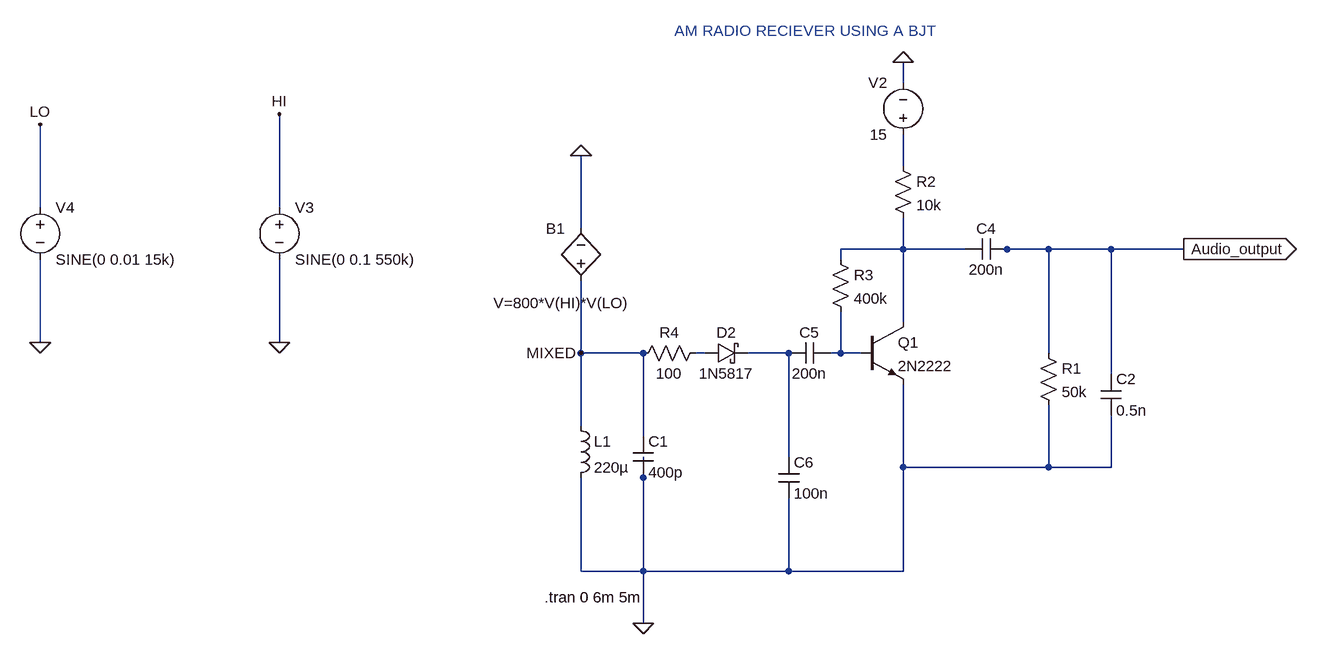
[diagram p0: schematic Circuit.asc]
Circuit.asc, the LTspice schematic file:
Version 4
SHEET 1 1720 680
WIRE 576 -384 576 -416
WIRE 576 -256 576 -304
WIRE -752 -192 -752 -320
WIRE -384 -192 -384 -336
WIRE 80 -160 80 -272
WIRE 576 -128 576 -176
WIRE 576 -128 480 -128
WIRE 672 -128 576 -128
WIRE 736 -128 720 -128
WIRE 800 -128 736 -128
WIRE 896 -128 800 -128
WIRE 1008 -128 896 -128
WIRE 480 -112 480 -128
WIRE 576 -16 576 -128
WIRE -752 16 -752 -112
WIRE -384 16 -384 -112
WIRE 80 32 80 -80
WIRE 176 32 80 32
WIRE 272 32 256 32
WIRE 400 32 336 32
WIRE 480 32 480 -32
WIRE 480 32 464 32
WIRE 512 32 480 32
WIRE 800 32 800 -128
WIRE 896 64 896 -128
WIRE 80 144 80 32
WIRE 176 160 176 32
WIRE 400 192 400 32
WIRE 576 208 576 80
WIRE 800 208 800 112
WIRE 800 208 576 208
WIRE 896 208 896 128
WIRE 896 208 800 208
WIRE 176 224 176 192
WIRE 80 368 80 224
WIRE 176 368 176 224
WIRE 176 368 80 368
WIRE 400 368 400 256
WIRE 400 368 176 368
WIRE 576 368 576 208
WIRE 576 368 400 368
WIRE 176 448 176 368
FLAG 576 -416 0
FLAG -384 16 0
FLAG -752 16 0
FLAG -384 -336 HI
FLAG -752 -320 LO
FLAG 80 -272 0
FLAG 80 32 MIXED
FLAG 176 448 0
FLAG 1008 -128 Audio_output
IOPIN 1008 -128 Out
SYMBOL ind 64 128 R0
SYMATTR InstName L1
SYMATTR Value 220µ
SYMBOL cap 160 160 R0
SYMATTR InstName C1
SYMATTR Value 400p
SYMBOL voltage 576 -288 R180
WINDOW 0 24 96 Left 2
WINDOW 3 24 16 Left 2
WINDOW 123 0 0 Left 0
WINDOW 39 0 0 Left 0
SYMATTR InstName V2
SYMATTR Value 15
SYMBOL res 560 -272 R0
SYMATTR InstName R2
SYMATTR Value 10k
SYMBOL voltage -384 -208 R0
WINDOW 123 0 0 Left 0
WINDOW 39 0 0 Left 0
SYMATTR InstName V3
SYMATTR Value SINE(0 0.1 550k)
SYMBOL voltage -752 -208 R0
WINDOW 123 0 0 Left 0
WINDOW 39 0 0 Left 0
SYMATTR InstName V4
SYMATTR Value SINE(0 0.01 15k)
SYMBOL bv 80 -64 R180
WINDOW 0 24 96 Left 2
WINDOW 3 -75 -19 Left 2
SYMATTR InstName B1
SYMATTR Value V=800*V(HI)*V(LO)
SYMBOL res 464 -128 R0
SYMATTR InstName R3
SYMATTR Value 400k
SYMBOL cap 736 -144 R90
WINDOW 0 0 32 VBottom 2
WINDOW 3 32 32 VTop 2
SYMATTR InstName C4
SYMATTR Value 200n
SYMBOL npn 512 -16 R0
SYMATTR InstName Q1
SYMATTR Value 2N2222
SYMBOL schottky 272 48 R270
WINDOW 0 32 32 VTop 2
WINDOW 3 0 32 VBottom 2
SYMATTR InstName D2
SYMATTR Value 1N5817
SYMATTR Description Diode
SYMATTR Type diode
SYMBOL cap 464 16 R90
WINDOW 0 0 32 VBottom 2
WINDOW 3 32 32 VTop 2
SYMATTR InstName C5
SYMATTR Value 200n
SYMBOL cap 384 192 R0
SYMATTR InstName C6
SYMATTR Value 100n
SYMBOL res 272 16 R90
WINDOW 0 0 56 VBottom 2
WINDOW 3 32 56 VTop 2
SYMATTR InstName R4
SYMATTR Value 100
SYMBOL res 784 16 R0
SYMATTR InstName R1
SYMATTR Value 50k
SYMBOL cap 880 64 R0
SYMATTR InstName C2
SYMATTR Value 0.5n
TEXT 24 408 Left 2 !.tran 0 6m 5m
TEXT 224 -464 Left 2 ;AM RADIO RECIEVER USING A BJT

The netlist it stands for:
* Circuit.asc
L1 MIXED 0 220µ
C1 MIXED 0 400p
V2 N001 0 15
R2 N001 N002 10k
V3 HI 0 SINE(0 0.1 550k)
V4 LO 0 SINE(0 0.01 15k)
B1 MIXED 0 V=800*V(HI)*V(LO)
R3 N002 N005 400k
C4 Audio_output N002 200n
Q1 N002 N005 0 0 2N2222
D2 N003 N004 1N5817
C5 N005 N004 200n
C6 N004 0 100n
R4 N003 MIXED 100
R1 Audio_output 0 50k
C2 Audio_output 0 0.5n
.model D D
.lib standard.dio
.model NPN NPN
.model PNP PNP
.lib standard.bjt
.tran 0 6m 5m
* AM RADIO RECIEVER USING A BJT
.backanno
.end